# Altium schematic sheet PATHOS_DriveConnectors.SchDoc: Drive Signal Distribution
size A4; Author: A. Kalberer; CompanyName: NTB; Organization: NTB Interstate University of Applied; Address1: Werdenbergstrasse 4; Address3: 9471 Buchs; Address4: Switzerland; DocumentNumber: 3; Revision: 0.1; SheetNumber: 3; SheetTotal: 5; Organization1: Sciences of Technology Buchs; Size: A4; ShortDescription: Level Shifter and Line Receiver for Drive Connector
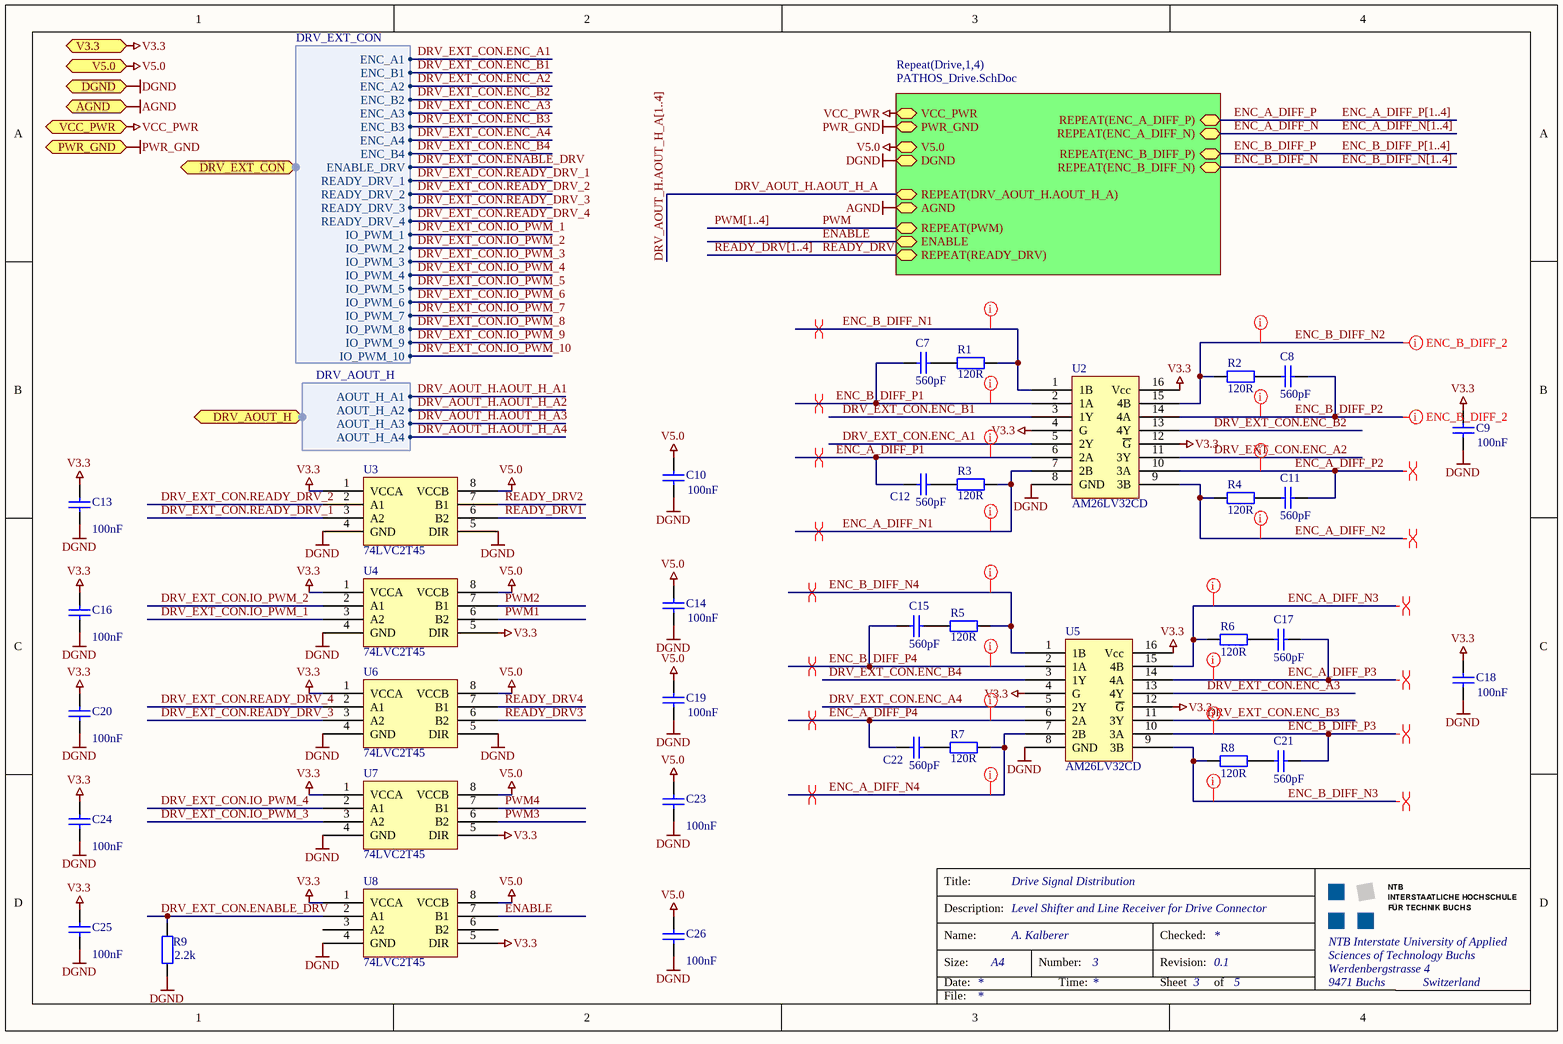
[diagram p0: PATHOS_DriveConnectors.SchDoc]

## Parts
C7  value 560pF  [0603_3D]  (hidden comment: Cap)
C8  value 560pF  [0603_3D]  (hidden comment: Cap)
C9  value 100nF  [0603_3D]  (hidden comment: Cap)
C10  value 100nF  [0603_3D]  (hidden comment: Cap)
C11  value 560pF  [0603_3D]  (hidden comment: Cap)
C12  value 560pF  [0603_3D]  (hidden comment: Cap)
C13  value 100nF  [0603_3D]  (hidden comment: Cap)
C14  value 100nF  [0603_3D]  (hidden comment: Cap)
C15  value 560pF  [0603_3D]  (hidden comment: Cap)
C16  value 100nF  [0603_3D]  (hidden comment: Cap)
C17  value 560pF  [0603_3D]  (hidden comment: Cap)
C18  value 100nF  [0603_3D]  (hidden comment: Cap)
C19  value 100nF  [0603_3D]  (hidden comment: Cap)
C20  value 100nF  [0603_3D]  (hidden comment: Cap)
C21  value 560pF  [0603_3D]  (hidden comment: Cap)
C22  value 560pF  [0603_3D]  (hidden comment: Cap)
C23  value 100nF  [0603_3D]  (hidden comment: Cap)
C24  value 100nF  [0603_3D]  (hidden comment: Cap)
C25  value 100nF  [0603_3D]  (hidden comment: Cap)
C26  value 100nF  [0603_3D]  (hidden comment: Cap)
R1  value 120R  [0603_3D]  (hidden comment: Res2)
R2  value 120R  [0603_3D]  (hidden comment: Res2)
R3  value 120R  [0603_3D]  (hidden comment: Res2)
R4  value 120R  [0603_3D]  (hidden comment: Res2)
R5  value 120R  [0603_3D]  (hidden comment: Res2)
R6  value 120R  [0603_3D]  (hidden comment: Res2)
R7  value 120R  [0603_3D]  (hidden comment: Res2)
R8  value 120R  [0603_3D]  (hidden comment: Res2)
R9  value 2.2k  [0603_3D]  (hidden comment: Res2)
U2  AM26LV32CD  [SOP16]
U3  74LVC2T45  [74LVC2T45]
U4  74LVC2T45  [74LVC2T45]
U5  AM26LV32CD  [SOP16]
U6  74LVC2T45  [74LVC2T45]
U7  74LVC2T45  [74LVC2T45]
U8  74LVC2T45  [74LVC2T45]

## Sub-sheets
Repeat(Drive,1,4) = PATHOS_Drive.SchDoc: VCC_PWR, PWR_GND, V5.0, DGND, REPEAT(DRV_AOUT_H.AOUT_H_A), AGND, REPEAT(ENC_A_DIFF_P), REPEAT(ENC_A_DIFF_N), REPEAT(ENC_B_DIFF_P), REPEAT(ENC_B_DIFF_N), REPEAT(PWM), ENABLE, REPEAT(READY_DRV)

## Ports
AGND, DGND, DRV_AOUT_H (harness DRV_AOUT_H), DRV_EXT_CON (harness DRV_EXT_CON), PWR_GND, V3.3, V5.0, VCC_PWR

## Harnesses
DRV_EXT_CON: ENC_A1, ENC_B1, ENC_A2, ENC_B2, ENC_A3, ENC_B3, ENC_A4, ENC_B4, ENABLE_DRV, IO_PWM_1, IO_PWM_2, IO_PWM_3, IO_PWM_4, IO_PWM_5, IO_PWM_6, IO_PWM_7, IO_PWM_8, READY_DRV_1, READY_DRV_2, READY_DRV_3, READY_DRV_4, IO_PWM_9, IO_PWM_10
DRV_AOUT_H: AOUT_H_A1, AOUT_H_A2, AOUT_H_A3, AOUT_H_A4

## Nets
AGND: port AGND, sheet Repeat(Drive,1,4)/AGND
DGND: C9.1 C10.1 C13.1 C14.1 C16.1 C18.1 C19.1 C20.1 C23.1 C24.1 C25.1 C26.1 R9.1 U2.8(GND) U3.4(GND) U3.5(DIR) U4.4(GND) U5.8(GND) U6.4(GND) U6.5(DIR) U7.4(GND) U8.4(GND) ; port DGND, sheet Repeat(Drive,1,4)/DGND
PWR_GND: port PWR_GND, sheet Repeat(Drive,1,4)/PWR_GND
V3.3: C9.2 C13.2 C16.2 C18.2 C20.2 C24.2 C25.2 U2.4(G) U2.12(~{G}) U2.16(Vcc) U3.1(VCCA) U4.1(VCCA) U4.5(DIR) U5.4(G) U5.12(~{G}) U5.16(Vcc) U6.1(VCCA) U7.1(VCCA) U7.5(DIR) U8.1(VCCA) U8.5(DIR) ; port V3.3
V5.0: C10.2 C14.2 C19.2 C23.2 C26.2 U3.8(VCCB) U4.8(VCCB) U6.8(VCCB) U7.8(VCCB) U8.8(VCCB) ; port V5.0, sheet Repeat(Drive,1,4)/V5.0
VCC_PWR: port VCC_PWR, sheet Repeat(Drive,1,4)/VCC_PWR
DRV_AOUT_H.AOUT_H_A: sheet Repeat(Drive,1,4)/REPEAT(DRV_AOUT_H.AOUT_H_A)
DRV_AOUT_H.AOUT_H_A1: port DRV_AOUT_H.AOUT_H_A1
DRV_AOUT_H.AOUT_H_A2: port DRV_AOUT_H.AOUT_H_A2
DRV_AOUT_H.AOUT_H_A3: port DRV_AOUT_H.AOUT_H_A3
DRV_AOUT_H.AOUT_H_A4: port DRV_AOUT_H.AOUT_H_A4
DRV_EXT_CON.ENABLE_DRV: R9.2 U8.2(A1) ; port DRV_EXT_CON.ENABLE_DRV
DRV_EXT_CON.ENC_A1: U2.5(2Y) ; port DRV_EXT_CON.ENC_A1
DRV_EXT_CON.ENC_A2: U2.11(3Y) ; port DRV_EXT_CON.ENC_A2
DRV_EXT_CON.ENC_A3: U5.13(4Y) ; port DRV_EXT_CON.ENC_A3
DRV_EXT_CON.ENC_A4: U5.5(2Y) ; port DRV_EXT_CON.ENC_A4
DRV_EXT_CON.ENC_B1: U2.3(1Y) ; port DRV_EXT_CON.ENC_B1
DRV_EXT_CON.ENC_B2: U2.13(4Y) ; port DRV_EXT_CON.ENC_B2
DRV_EXT_CON.ENC_B3: U5.11(3Y) ; port DRV_EXT_CON.ENC_B3
DRV_EXT_CON.ENC_B4: U5.3(1Y) ; port DRV_EXT_CON.ENC_B4
DRV_EXT_CON.IO_PWM_1: U4.3(A2) ; port DRV_EXT_CON.IO_PWM_1
DRV_EXT_CON.IO_PWM_2: U4.2(A1) ; port DRV_EXT_CON.IO_PWM_2
DRV_EXT_CON.IO_PWM_3: U7.3(A2) ; port DRV_EXT_CON.IO_PWM_3
DRV_EXT_CON.IO_PWM_4: U7.2(A1) ; port DRV_EXT_CON.IO_PWM_4
DRV_EXT_CON.IO_PWM_5: port DRV_EXT_CON.IO_PWM_5
DRV_EXT_CON.IO_PWM_6: port DRV_EXT_CON.IO_PWM_6
DRV_EXT_CON.IO_PWM_7: port DRV_EXT_CON.IO_PWM_7
DRV_EXT_CON.IO_PWM_8: port DRV_EXT_CON.IO_PWM_8
DRV_EXT_CON.IO_PWM_9: port DRV_EXT_CON.IO_PWM_9
DRV_EXT_CON.IO_PWM_10: port DRV_EXT_CON.IO_PWM_10
DRV_EXT_CON.READY_DRV_1: U3.3(A2) ; port DRV_EXT_CON.READY_DRV_1
DRV_EXT_CON.READY_DRV_2: U3.2(A1) ; port DRV_EXT_CON.READY_DRV_2
DRV_EXT_CON.READY_DRV_3: U6.3(A2) ; port DRV_EXT_CON.READY_DRV_3
DRV_EXT_CON.READY_DRV_4: U6.2(A1) ; port DRV_EXT_CON.READY_DRV_4
ENABLE: U8.7(B1) ; sheet Repeat(Drive,1,4)/ENABLE
ENC_A_DIFF_N: sheet Repeat(Drive,1,4)/REPEAT(ENC_A_DIFF_N)
ENC_A_DIFF_N1: R3.1 U2.7(2B)
ENC_A_DIFF_N2: R4.1 U2.9(3B)
ENC_A_DIFF_N3: R6.1 U5.15(4B)
ENC_A_DIFF_N4: R7.1 U5.7(2B)
ENC_A_DIFF_P: sheet Repeat(Drive,1,4)/REPEAT(ENC_A_DIFF_P)
ENC_A_DIFF_P1: C12.2 U2.6(2A)
ENC_A_DIFF_P2: C11.1 U2.10(3A)
ENC_A_DIFF_P3: C17.1 U5.14(4A)
ENC_A_DIFF_P4: C22.2 U5.6(2A)
ENC_B_DIFF_N: sheet Repeat(Drive,1,4)/REPEAT(ENC_B_DIFF_N)
ENC_B_DIFF_N1: R1.1 U2.1(1B)
ENC_B_DIFF_N2: R2.1 U2.15(4B)
ENC_B_DIFF_N3: R8.1 U5.9(3B)
ENC_B_DIFF_N4: R5.1 U5.1(1B)
ENC_B_DIFF_P: sheet Repeat(Drive,1,4)/REPEAT(ENC_B_DIFF_P)
ENC_B_DIFF_P1: C7.2 U2.2(1A)
ENC_B_DIFF_P2: C8.1 U2.14(4A)
ENC_B_DIFF_P3: C21.1 U5.10(3A)
ENC_B_DIFF_P4: C15.2 U5.2(1A)
PWM: sheet Repeat(Drive,1,4)/REPEAT(PWM)
PWM1: U4.6(B2)
PWM2: U4.7(B1)
PWM3: U7.6(B2)
PWM4: U7.7(B1)
READY_DRV: sheet Repeat(Drive,1,4)/REPEAT(READY_DRV)
READY_DRV1: U3.6(B2)
READY_DRV2: U3.7(B1)
READY_DRV3: U6.6(B2)
READY_DRV4: U6.7(B1)
NetC7_1: C7.1 R1.2
NetC8_2: C8.2 R2.2
NetC11_2: C11.2 R4.2
NetC12_1: C12.1 R3.2
NetC15_1: C15.1 R5.2
NetC17_2: C17.2 R6.2
NetC21_2: C21.2 R8.2
NetC22_1: C22.1 R7.2

Not connected (* = marked no-connect by the designer): U8 3(A2) 6(B2)

## Buses and harness runs
bus DRV_AOUT_H.AOUT_H_A[1..4]
bus ENC_A_DIFF_N[1..4]
bus ENC_A_DIFF_P[1..4]
bus ENC_B_DIFF_N[1..4]
bus ENC_B_DIFF_P[1..4]
bus PWM[1..4]
bus READY_DRV[1..4]

## Layout directives
differential pair: ENC_A_DIFF_N1, ENC_A_DIFF_N2, ENC_A_DIFF_N3, ENC_A_DIFF_N4, ENC_A_DIFF_P1, ENC_A_DIFF_P2, ENC_A_DIFF_P3, ENC_A_DIFF_P4, ENC_B_DIFF_N1, ENC_B_DIFF_N2, ENC_B_DIFF_N3, ENC_B_DIFF_N4, ENC_B_DIFF_P1, ENC_B_DIFF_P2, ENC_B_DIFF_P3, ENC_B_DIFF_P4
net class ENC_A_DIFF_1: ENC_A_DIFF_N1, ENC_A_DIFF_P1
net class ENC_B_DIFF_1: ENC_B_DIFF_N1, ENC_B_DIFF_P1
net class ENC_A_DIFF_2: ENC_A_DIFF_N2, ENC_A_DIFF_P2
net class ENC_B_DIFF_2: ENC_B_DIFF_N2, ENC_B_DIFF_P2
net class ENC_B_DIFF_4: ENC_B_DIFF_N4, ENC_B_DIFF_P4
net class ENC_A_DIFF_4: ENC_A_DIFF_N4, ENC_A_DIFF_P4
net class ENC_B_DIFF_3: ENC_B_DIFF_N3, ENC_B_DIFF_P3
net class ENC_A_DIFF_3: ENC_A_DIFF_N3, ENC_A_DIFF_P3

## Notes on the sheet
- Title:
- Description:
- Size:
- Date:
- Name:
- Number:
- Time:
- Revision:
- Sheet
- Checked:
- of
- File:

## Library data of the parts
C7-C26 = Cap: Capacitor; Published: 8-Jun-2000; LatestRevisionDate: 17-Jul-2002; LatestRevisionNote: Re-released for DXP Platform.; PackageReference: RAD-0.3; Publisher: Altium Limited; PackageDescription: Radial Cap, Thru-Hole; 2 Leads; 0.3 in Pin Spacing
R1-R9 = Res2: Resistor; Published: 8-Jun-2000; LatestRevisionDate: 17-Jul-2002; LatestRevisionNote: Re-released for DXP Platform.; PackageReference: AXIAL-0.4; Publisher: Altium Limited; PackageDescription: Axial Device, Thru-Hole; 2 Leads; 0.4 in Pin Spacing
U3 U4 U6-U8 = 74LVC2T45: SN74LVC2T45DCTR